# Altium schematic sheet 03_Connectors.SchDoc: Off Board Connectors
size A; Revision: A; SheetNumber: 3; SheetTotal: 8; ECE315_Project_Name: ECE453 MCU Base Project
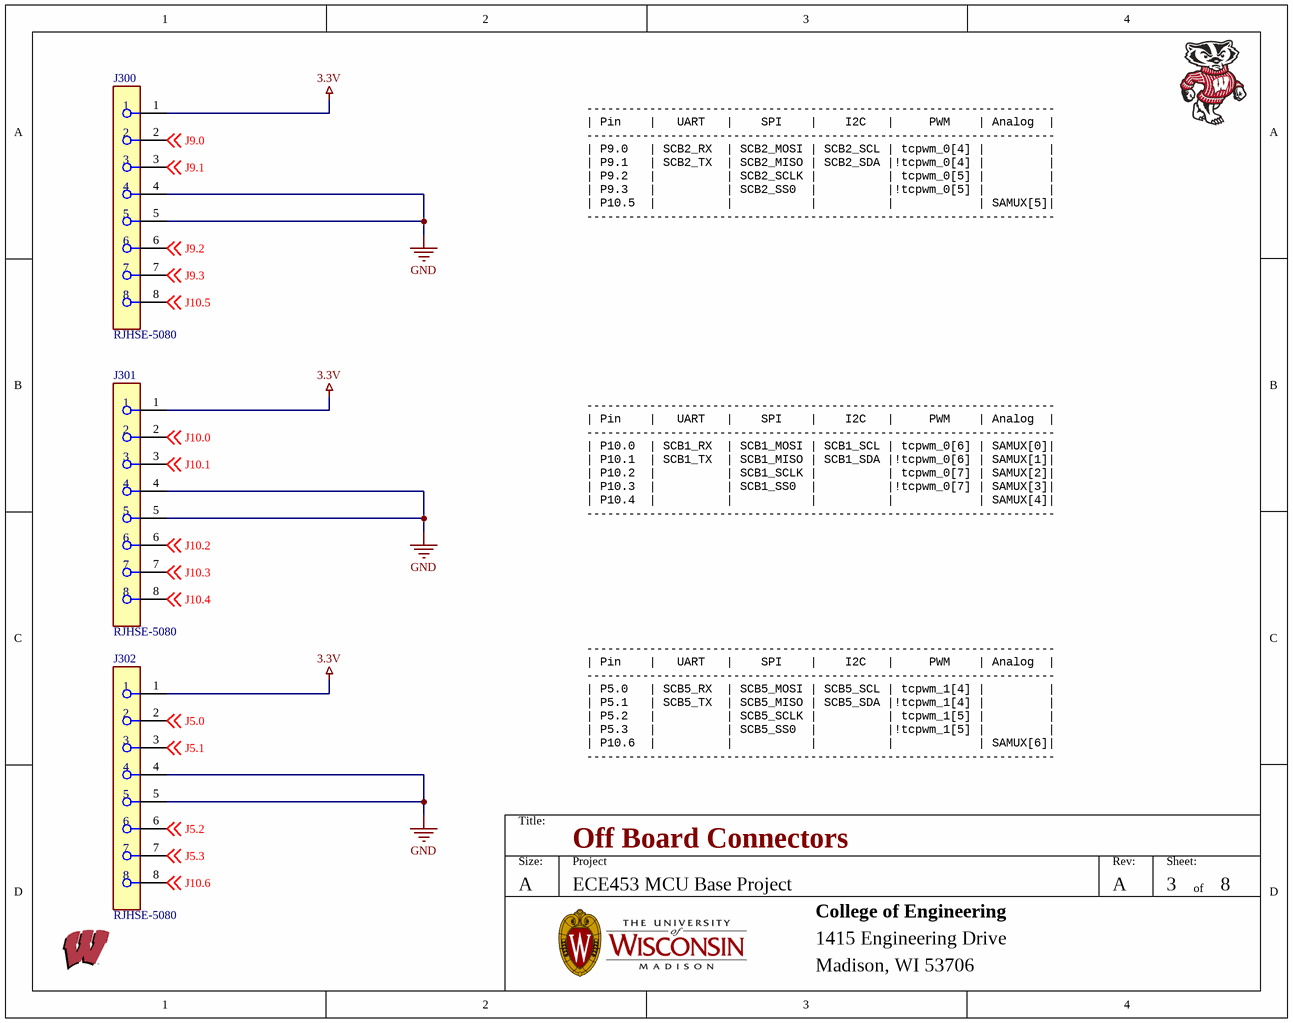
[diagram p0: 03_Connectors.SchDoc]

## Parts
J300  RJHSE-5080  [FP-RJHSE-5080-MFG]
J301  RJHSE-5080  [FP-RJHSE-5080-MFG]
J302  RJHSE-5080  [FP-RJHSE-5080-MFG]

## Nets
3.3V: J300.1 J301.1 J302.1
GND: J300.4 J300.5 J301.4 J301.5 J302.4 J302.5
J5.0: J302.2 ; off-sheet J5.0
J5.1: J302.3 ; off-sheet J5.1
J5.2: J302.6 ; off-sheet J5.2
J5.3: J302.7 ; off-sheet J5.3
J9.0: J300.2 ; off-sheet J9.0
J9.1: J300.3 ; off-sheet J9.1
J9.2: J300.6 ; off-sheet J9.2
J9.3: J300.7 ; off-sheet J9.3
J10.0: J301.2 ; off-sheet J10.0
J10.1: J301.3 ; off-sheet J10.1
J10.2: J301.6 ; off-sheet J10.2
J10.3: J301.7 ; off-sheet J10.3
J10.4: J301.8 ; off-sheet J10.4
J10.5: J300.8 ; off-sheet J10.5
J10.6: J302.8 ; off-sheet J10.6

## Notes on the sheet
- -------------------------------------------------------------------
  | Pin    |   UART   |    SPI    |    I2C   |     PWM    | Analog  |
  -------------------------------------------------------------------
  | P9.0   | SCB2_RX  | SCB2_MOSI | SCB2_SCL | tcpwm_0[4] |         |
  | P9.1   | SCB2_TX  | SCB2_MISO | SCB2_SDA |!tcpwm_0[4] |         |
  | P9.2   |          | SCB2_SCLK |          | tcpwm_0[5] |         |
  | P9.3   |          | SCB2_SS0  |          |!tcpwm_0[5] |         |
  | P10.5  |          |           |          |            | SAMUX[5]|
  -------------------------------------------------------------------
- -------------------------------------------------------------------
  | Pin    |   UART   |    SPI    |    I2C   |     PWM    | Analog  |
  -------------------------------------------------------------------
  | P10.0  | SCB1_RX  | SCB1_MOSI | SCB1_SCL | tcpwm_0[6] | SAMUX[0]|
  | P10.1  | SCB1_TX  | SCB1_MISO | SCB1_SDA |!tcpwm_0[6] | SAMUX[1]|
  | P10.2  |          | SCB1_SCLK |          | tcpwm_0[7] | SAMUX[2]|
  | P10.3  |          | SCB1_SS0  |          |!tcpwm_0[7] | SAMUX[3]|
  | P10.4  |          |           |          |            | SAMUX[4]|
  -------------------------------------------------------------------
- -------------------------------------------------------------------
  | Pin    |   UART   |    SPI    |    I2C   |     PWM    | Analog  |
  -------------------------------------------------------------------
  | P5.0   | SCB5_RX  | SCB5_MOSI | SCB5_SCL | tcpwm_1[4] |         |
  | P5.1   | SCB5_TX  | SCB5_MISO | SCB5_SDA |!tcpwm_1[4] |         |
  | P5.2   |          | SCB5_SCLK |          | tcpwm_1[5] |         |
  | P5.3   |          | SCB5_SS0  |          |!tcpwm_1[5] |         |
  | P10.6  |          |           |          |            | SAMUX[6]|
  -------------------------------------------------------------------
- Title:
- Size:
- A
- Project
- Rev:
- Sheet:
- of
- College of Engineering
- 1415 Engineering Drive
- Madison, WI 53706

## Library data of the parts
J300-J302 = CMP-02366-000003-1: CONN MOD JACK 8P8C R/A UNSHLD; Manufacturer: Amphenol; Current Rating: 1.5A; Voltage Rating: 125V; Pitch: 1.02mm; Conn Orientation: Right Angle; Number Of Contacts: 8; Is Female: yes; Conn Gender: Female; Contact Resistance: 20mR; Number of Ports: 1; Connector Type: RJ45; Lead Free: Yes; Device Class L3: unset; Footprint Url: https://cdn.amphenol-icc.com/media/wysiwyg/files/drawing/rjhse5080.pdf?__cf_chl_jschl_tk__=e349db0bbbb6188a39347cd5e541b92fa02c9719-1587748343-0-AW7tChdeHzRPLX9gSWj7WrKaXQoY9BsmT9Ek0h-T62M9y3Rs9iypFcOtkzb-6sGYQEjFE-jcoNciDETCOZrh1rYyOesac5SvYLoLwHIsHvF4AKBlx-MXmfZUVk9OTTJLqyQq2qMm0PFRLJpNcK0nrKResqOniRSYixG2sPTmOPraH-ULJFBDL602CHqcI9KKBgTq90Jh1OL2Td4moJ99rFsJRJ1Tk_uoxGe8ublcP_ARu-uLpWcQrBcwOcHDTAwL29DAwVaqcH7ta8Ks7WMlHmVl_pILeEDwT0bE9vu5Pa5S3PtNRF1leuFkgi_FMbUxTDulc5xzbXSfng8srUIV1lWXny5nx1fZJEUa_w97yKjffzBMxiWLWVN-V7-uqAaPbyv_m-wRyw5O25OZNyJOeGU; ComponentLink2URL: https://cdn.amphenol-icc.com/media/wysiwyg/files/documentation/datasheet/inputoutput/io-modjack-rjhse.pdf; Device Class L1: Connectors; Package: CONN_MOD_JACK; Mouser Description: Modular Connectors / Ethernet Connectors R/A RJ45 NONSHIELDED 8 CONT NO LEDS; Manufacturer Part Number: RJHSE-5080; Octopart: https://octopart.com/rjhse-5080-amphenol-45060; Category: Conn; Height: 0.535inch; Temperature: -55°C to +85°C; Digikey Description: CONN MOD JACK 8P8C R/A UNSHLD; Device Class L2: Modular / Ethernet Connectors; Contact Material: Gold,Nickel; ComponentLink2Description: Datasheet; Temperature Range Low: -55°C; RoHS: TRUE; Automotive: No; Temperature Range High: +85°C; Supplier: Digikey; Supplier Part Number: RJHSE-5080-ND; Stock: 72112; Pricing: 1=1.03, 10=0.867, 25=0.832, 50=0.8142, 100=0.7788, 250=0.708, 500=0.6372, 1000=0.56641, 2500=0.51331 (USD); Mounting Technology: Through Hole,Panel; Contact Plating: Gold; Max Current Rating: 1.5A; Number of Positions Loaded: 8; Max Voltage Rating (AC): 125V; Orientation: Right Angle; Packaging: Rail/Tube; Gender: Female; Termination: Solder; Number of Positions: 8; Voltage Rating (DC): 125V; Length: 15.75mm; Depth: 14.99mm; Radiation Hardening: No; RoHS Compliant: Yes; Reach SVHC Compliant: Unknown; ComponentLink1URL: https://datasheet.ciiva.com/7629/1682821-7629402.pdf?src-supplier=Element14; ComponentLink1Description: https://datasheet.ciiva.com/7629/1682821-7629402.pdf?src-supplier=Element14; ComponentLink3URL: https://datasheet.ciiva.com/1432/1693748-1432448.pdf?src-supplier=Element14; ComponentLink3Description: https://datasheet.ciiva.com/1432/1693748-1432448.pdf?src-supplier=Element14